# EAGLE design Mixer-Analog-OPA2134-Rev-K2 (EAGLE 8.5.2)
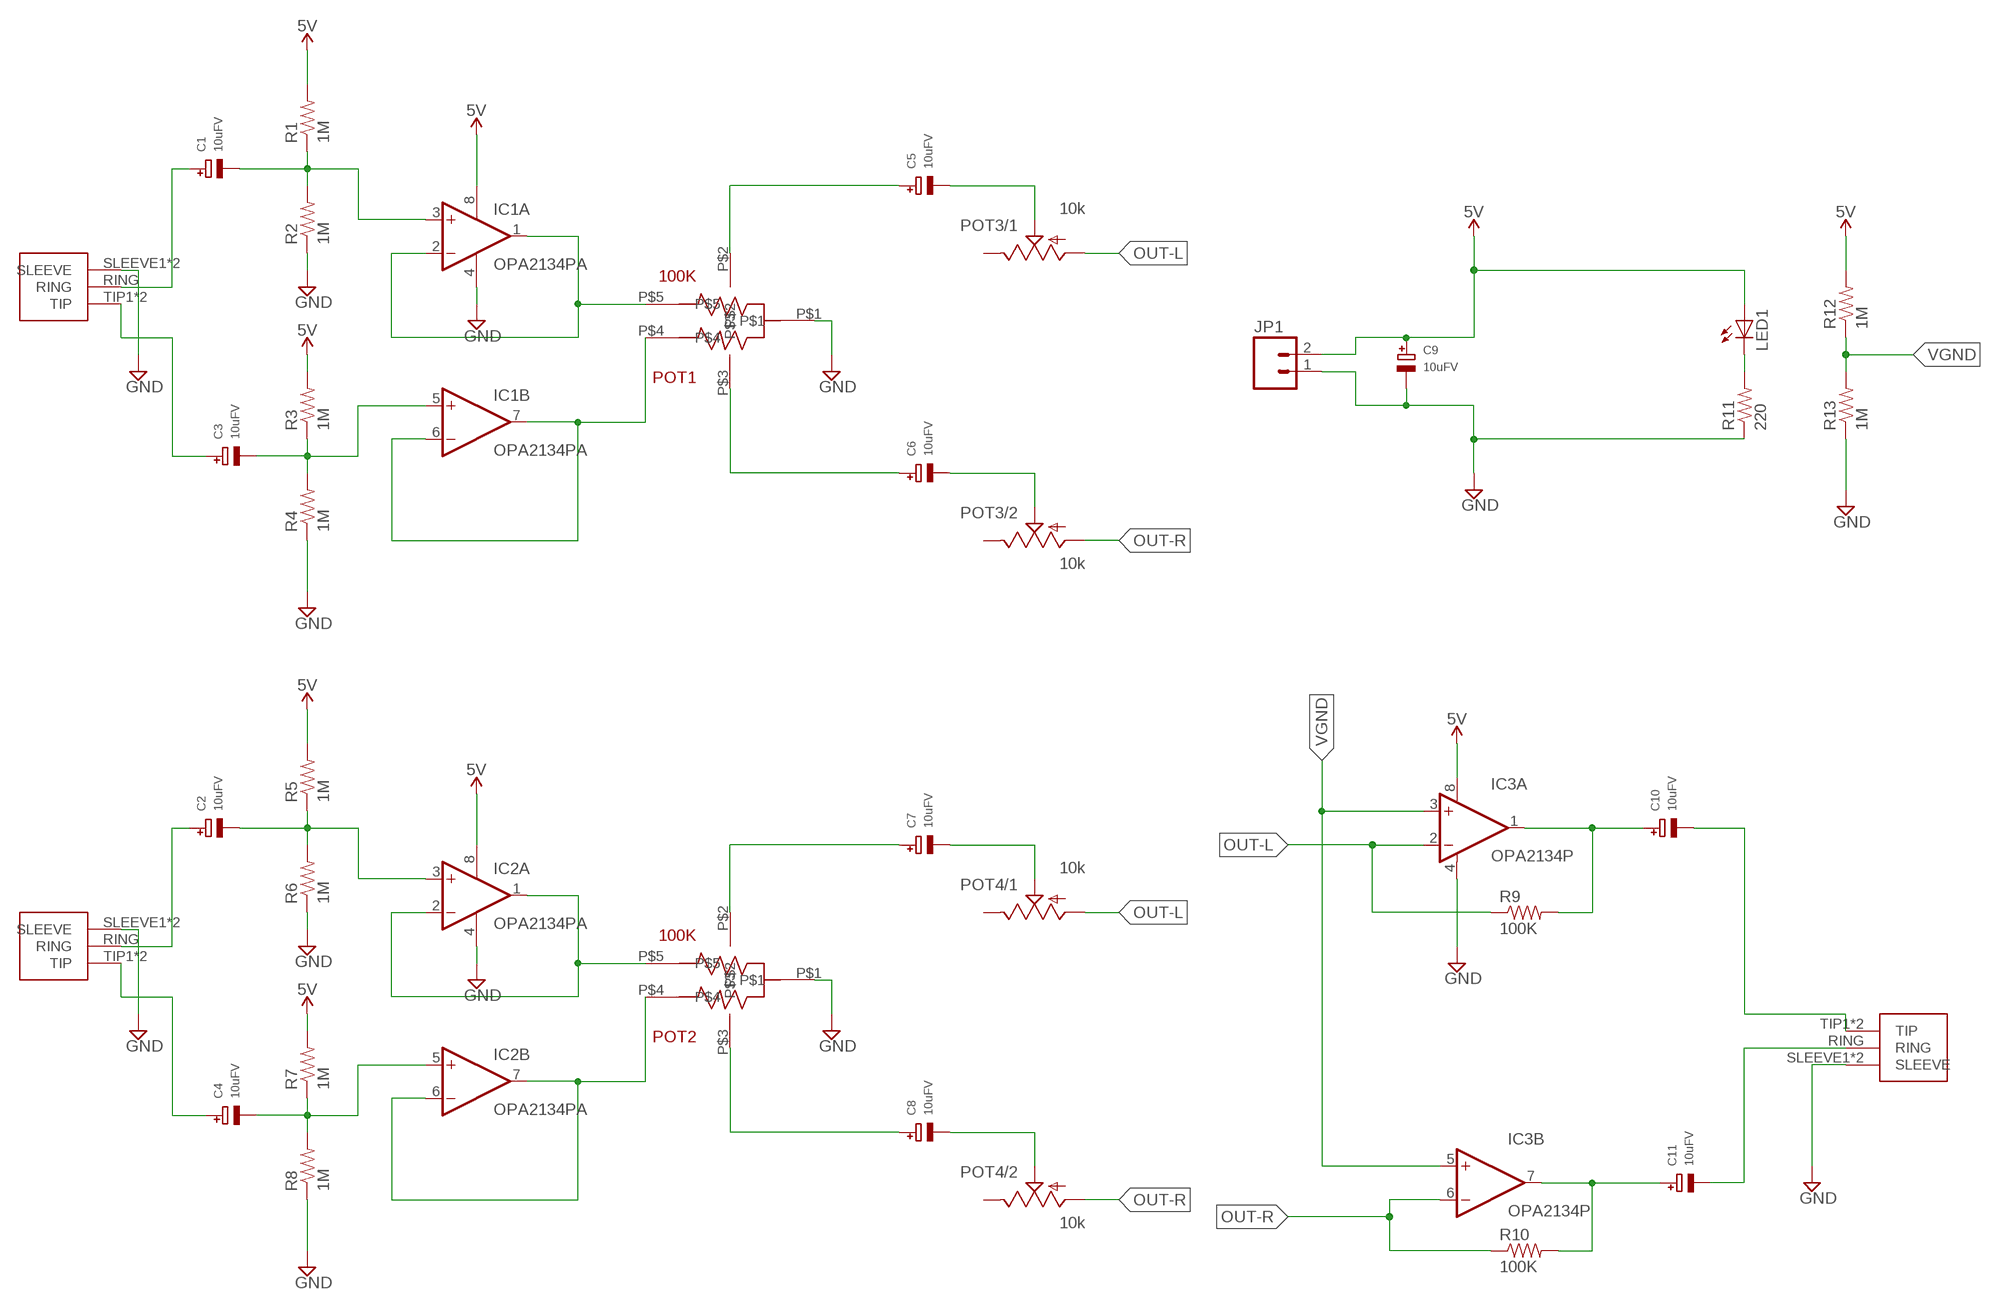
[diagram p0: schematic, sheet 1]

## Parts
C1  10uFV  CAP_ELECTROLYTICPTH_3.5MMGRID_8MMDIA  [CELEC_3.5MM_8MM]
C2  10uFV  CAP_ELECTROLYTICPTH_3.5MMGRID_8MMDIA  [CELEC_3.5MM_8MM]
C3  10uFV  CAP_ELECTROLYTICPTH_3.5MMGRID_8MMDIA  [CELEC_3.5MM_8MM]
C4  10uFV  CAP_ELECTROLYTICPTH_3.5MMGRID_8MMDIA  [CELEC_3.5MM_8MM]
C5  10uFV  CAP_ELECTROLYTICPTH_3.5MMGRID_8MMDIA  [CELEC_3.5MM_8MM]
C6  10uFV  CAP_ELECTROLYTICPTH_3.5MMGRID_8MMDIA  [CELEC_3.5MM_8MM]
C7  10uFV  CAP_ELECTROLYTICPTH_3.5MMGRID_8MMDIA  [CELEC_3.5MM_8MM]
C8  10uFV  CAP_ELECTROLYTICPTH_3.5MMGRID_8MMDIA  [CELEC_3.5MM_8MM]
C9  10uFV  CAP_ELECTROLYTICPTH_3.5MMGRID_8MMDIA  [CELEC_3.5MM_8MM]
C10  10uFV  CAP_ELECTROLYTICPTH_3.5MMGRID_8MMDIA  [CELEC_3.5MM_8MM]
C11  10uFV  CAP_ELECTROLYTICPTH_3.5MMGRID_8MMDIA  [CELEC_3.5MM_8MM]
IC1  OPA2134PA  [DIL08]
IC2  OPA2134PA  [DIL08]
IC3  OPA2134P  [DIL08]
J1  1/8"-F-STEREO-PCB  [1/8"-F-STEREO-PCB]
J2  1/8"-F-STEREO-PCB  [1/8"-F-STEREO-PCB]
J3  1/8"-F-STEREO-PCB  [1/8"-F-STEREO-PCB]
JP1  M02LOCK  [1X02_LOCK]
LED1  LED3MM  [LED3MM]
POT1  100K  POT-DUAL-ALPS-RK10J12E0A0A  [POT-DUAL-ALPS-RK10J12E0A0A]
POT2  100K  POT-DUAL-ALPS-RK10J12E0A0A  [POT-DUAL-ALPS-RK10J12E0A0A]
POT3  10k  POT-DUAL-PTV112-4420  [PTV112]
POT4  10k  POT-DUAL-PTV112-4420  [PTV112]
R1  1M  RESISTOREZ  [AXIAL-0.3EZ]
R2  1M  RESISTORAXIAL-0.3  [AXIAL-0.3]
R3  1M  RESISTOREZ  [AXIAL-0.3EZ]
R4  1M  RESISTOREZ  [AXIAL-0.3EZ]
R5  1M  RESISTOREZ  [AXIAL-0.3EZ]
R6  1M  RESISTORAXIAL-0.3  [AXIAL-0.3]
R7  1M  RESISTOREZ  [AXIAL-0.3EZ]
R8  1M  RESISTOREZ  [AXIAL-0.3EZ]
R9  100K  RESISTOREZ  [AXIAL-0.3EZ]
R10  100K  RESISTOREZ  [AXIAL-0.3EZ]
R11  220  RESISTOREZ  [AXIAL-0.3EZ]
R12  1M  RESISTOREZ  [AXIAL-0.3EZ]
R13  1M  RESISTOREZ  [AXIAL-0.3EZ]

## Nets
5V: C9.+ IC1.8(A:V+) IC2.8(A:V+) IC3.8(A:V+) JP1.2 LED1.A R1.P$2 R3.P$2 R5.P$2 R7.P$2 R12.P$2
GND: C9.- IC1.4(A:V-) IC2.4(A:V-) IC3.4(A:V-) J1.SLEEVE1(SLEEVE) J1.SLEEVE2(SLEEVE) J2.SLEEVE1(SLEEVE) J2.SLEEVE2(SLEEVE) J3.SLEEVE1(SLEEVE) J3.SLEEVE2(SLEEVE) JP1.1 POT1.P$1 POT2.P$1 R2.P$1 R4.P$1 R6.P$1 R8.P$1 R11.P$1 R13.P$1
N$1: C5.+ POT1.P$2
N$2: C5.- POT3.1.2(/1:S)
N$3: C6.+ POT1.P$3
N$4: C7.- POT4.1.2(/1:S)
N$5: C1.+ J1.RING
N$6: C6.- POT3.2.2(/2:S)
N$7: C10.+ IC3.1(A:OUT) R9.P$2
N$8: C1.- IC1.3(A:+IN) R1.P$1 R2.P$2
N$9: C3.+ J1.TIP1(TIP) J1.TIP2(TIP)
N$10: C8.- POT4.2.2(/2:S)
N$11: C2.+ J2.RING
N$12: C4.+ J2.TIP1(TIP) J2.TIP2(TIP)
N$13: C2.- IC2.3(A:+IN) R5.P$1 R6.P$2
N$14: C4.- IC2.5(B:+IN) R7.P$1 R8.P$2
N$15: LED1.K(C) R11.P$2
N$16: IC2.6(B:-IN) IC2.7(B:OUT) POT2.P$4
N$17: C11.+ IC3.7(B:OUT) R10.P$2
N$18: C3.- IC1.5(B:+IN) R3.P$1 R4.P$2
N$19: IC1.6(B:-IN) IC1.7(B:OUT) POT1.P$4
N$20: C7.+ POT2.P$2
N$21: C8.+ POT2.P$3
N$61: C10.- J3.TIP1(TIP) J3.TIP2(TIP)
N$62: C11.- J3.RING
OUT-L: IC3.2(A:-IN) POT3.1.1(/1:A) POT4.1.1(/1:A) R9.P$1
OUT-R: IC3.6(B:-IN) POT3.2.1(/2:A) POT4.2.1(/2:A) R10.P$1
POT1: IC1.1(A:OUT) IC1.2(A:-IN) POT1.P$5
POT2: IC2.1(A:OUT) IC2.2(A:-IN) POT2.P$5
VGND: IC3.3(A:+IN) IC3.5(B:+IN) R12.P$1 R13.P$2
Unconnected: POT3.1.3(/1:E) POT3.2.3(/2:E) POT4.1.3(/1:E) POT4.2.3(/2:E)

## Library data of the parts
C1-C11 = microbuilder:CAP_ELECTROLYTIC: Electrolytic Capacitors SMT PANASONIC_C - Size C Panasonic Electrolytic Aluminum Capacitor 47µF 16V 20% Electrolytic Capacitor [Digikey: PCE3890TR-ND] PANASONIC_D - Size D Panasonic Electrolytic Aluminum Capacitor 100µF 25V 20% Electrolytic Capacitor [Digikey: PCE3898TR-ND] PTH 3.5 mm grid, 8 mm diameter ... 3.5 mm grid, 10 mm diameter ...
IC1 IC2 = linear:OPA2*: Dual Operational Amplifier Low Power, Single-Supply, Rail-To-Rail Operational Amplifier Source: http://focus.ti.com/lit/ds/symlink/opa2345.pdf http://focus.ti.com .. opa241.pdf http://focus.ti.com/lit/ds/symlink/opa2134.pdf
IC3 = burr-brown:OPA2134: Operational Amplifier; MF: TEXAS INSTRUMENTS; MPN: OPA2134PA; OC_FARNELL: 1097574; OC_NEWARK: 74K3897
J1-J3 = CMU-ArtFab:1/8"-F-STEREO-PCB
JP1 = CMU-ArtFab:M02: Header 2 Standard 2-pin 0.1" header. Use with straight break away headers (SKU : PRT-00116), right angle break away headers (PRT-00553), swiss pins (PRT-00743), machine pins (PRT-00117), and female headers (PRT-00115). Molex polarized connector foot print use with SKU : PRT-08233 with associated crimp pins and housings.
LED1 = led:LED: LED OSRAM: - CHIPLED LG R971, LG N971, LY N971, LG Q971, LY Q971, LO R971, LY R971 LH N974, LH R974 LS Q976, LO Q976, LY Q976 LO Q996 - Hyper CHIPLED LW Q18S LB Q993, LB Q99A, LB R99A - SideLED LS A670, LO A670, LY A670, LG A670, LP A670 LB A673, LV A673, LT A673, LW A673 LH A674 LY A675 LS A676, LA A676, LO A676, LY A676, LW A676 LS A679, LY A679, LG A679 - Hyper Micro SIDELED® LS Y876, LA Y876, LO Y876, LY Y876 LT Y87S - SmartLED LW L88C, LW L88S LB L89C, LB L89S, LG L890 LS L89K, LO L89K, LY L89K LS L896, LA L896, LO L896, LY L896 - TOPLED LS T670, LO T670, LY T670, LG T670, LP T670 LSG T670, LSP T670, LSY T670, LOP T670, LYG T670 LG T671, LOG T671, LSG T671 LB T673, LV T673, LT T673, LW T673 LH T674 LS T676, LA T676, LO T676, LY T676, LB T676, LH T676, LSB T676, LW T676 LB T67C, LV T67C, LT T67C, LS T67K, LO T67K, LY T67K, LW E67C LS E67B, LA E67B, LO E67B, LY E67B, LB E67C, LV E67C, LT E67C LW T67C LS T679, LY T679, LG T679 LS T770, LO T770, LY T770, LG T770, LP T770 LB T773, LV T773, LT T773, LW T773 LH T774 LS E675, LA E675, LY E675, LS T675 LS T776, LA T776, LO T776, LY T776, LB T776 LHGB T686 LT T68C, LB T68C - Hyper Mini TOPLED® LB M676 - Mini TOPLED Santana® LG M470 LS M47K, LO M47K, LY M47K Source: http://www.osram.convergy.de LUXEON: - LUMILED® LXK2-PW12-R00, LXK2-PW12-S00, LXK2-PW14-U00, LXK2-PW14-V00 LXK2-PM12-R00, LXK2-PM12-S00, LXK2-PM14-U00 LXK2-PE12-Q00, LXK2-PE12-R00, LXK2-PE12-S00, LXK2-PE14-T00, LXK2-PE14-U00 LXK2-PB12-K00, LXK2-PB12-L00, LXK2-PB12-M00, LXK2-PB14-N00, LXK2-PB14-P00, LXK2-PB14-Q00 LXK2-PR12-L00, LXK2-PR12-M00, LXK2-PR14-Q00, LXK2-PR14-R00 LXK2-PD12-Q00, LXK2-PD12-R00, LXK2-PD12-S00 LXK2-PH12-R00, LXK2-PH12-S00 LXK2-PL12-P00, LXK2-PL12-Q00, LXK2-PL12-R00 Source: www.luxeon.com KINGBRIGHT: KA-3528ASYC Source: www.kingbright.com
POT1 POT2 = CMU-ArtFab:POT-DUAL-ALPS-RK10J12E0A0A
POT3 POT4 = CMU-ArtFab:POT-DUAL-PTV112: Bourns 11mm dual potentiometer; AVAILABILITY: Unavailable; DESCRIPTION: Alt# Tce-10111410; MF: STMicroelectronics; MP: PTV112; PACKAGE: None; PRICE: None; SPICEPREFIX: J
R1-R10 = SparkFun-Passives:RESISTOR: Resistor Basic schematic elements and footprints for 0603, 1206, and PTH resistors.; SPICEPREFIX: R
R11-R13 = SparkFun-Passives:RESISTOR: Resistor Basic schematic elements and footprints for 0603, 1206, and PTH resistors.

## Board
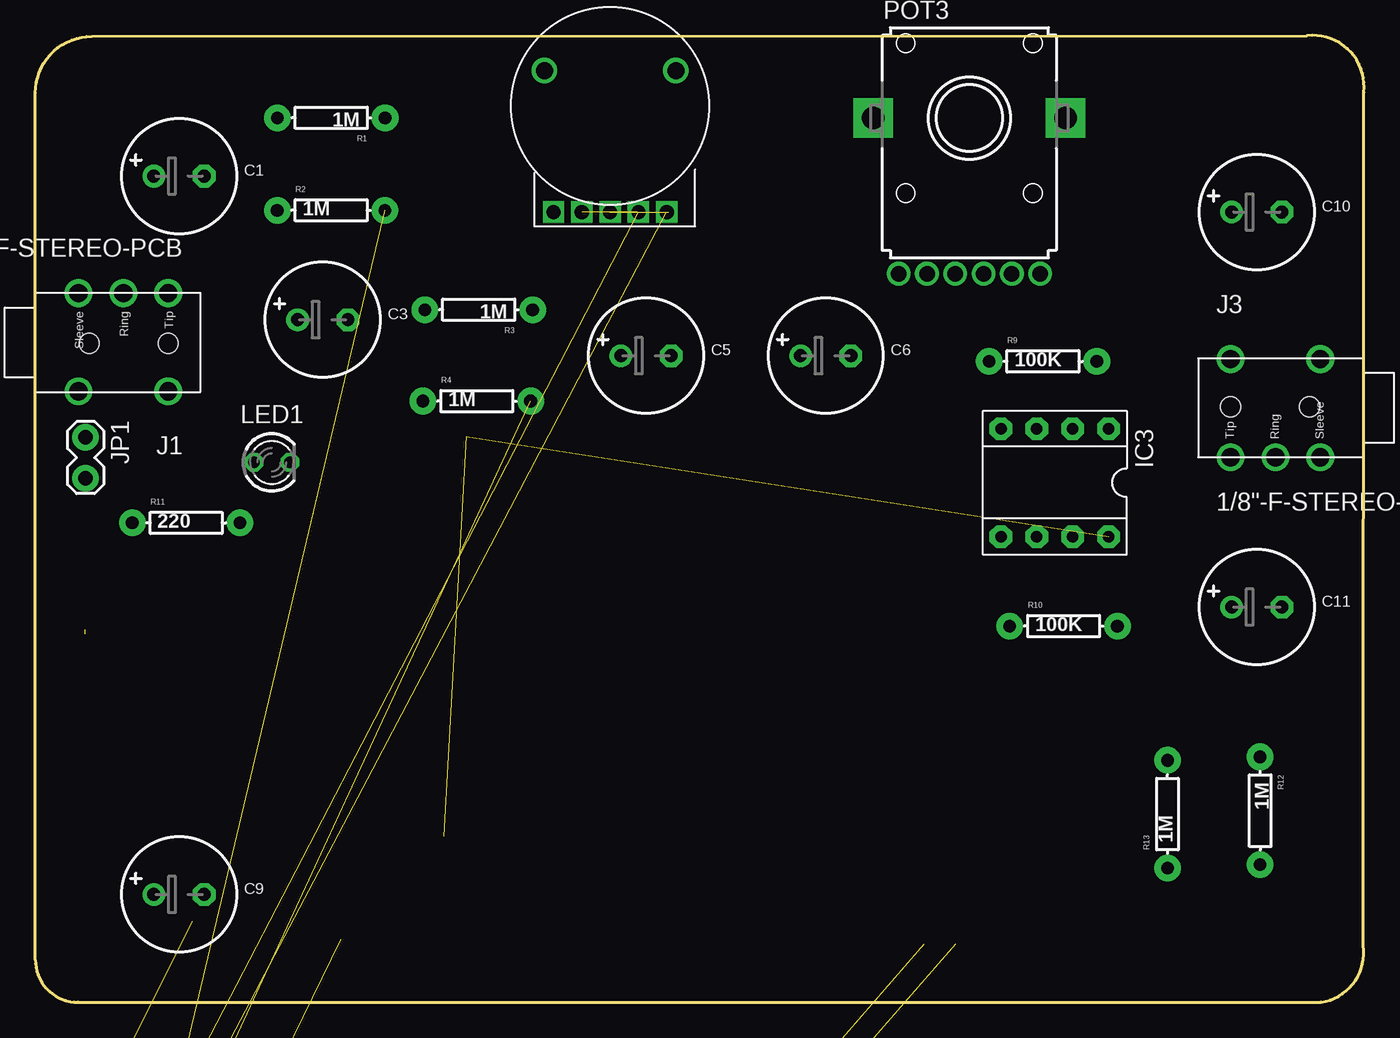
[diagram p1: board, top side]
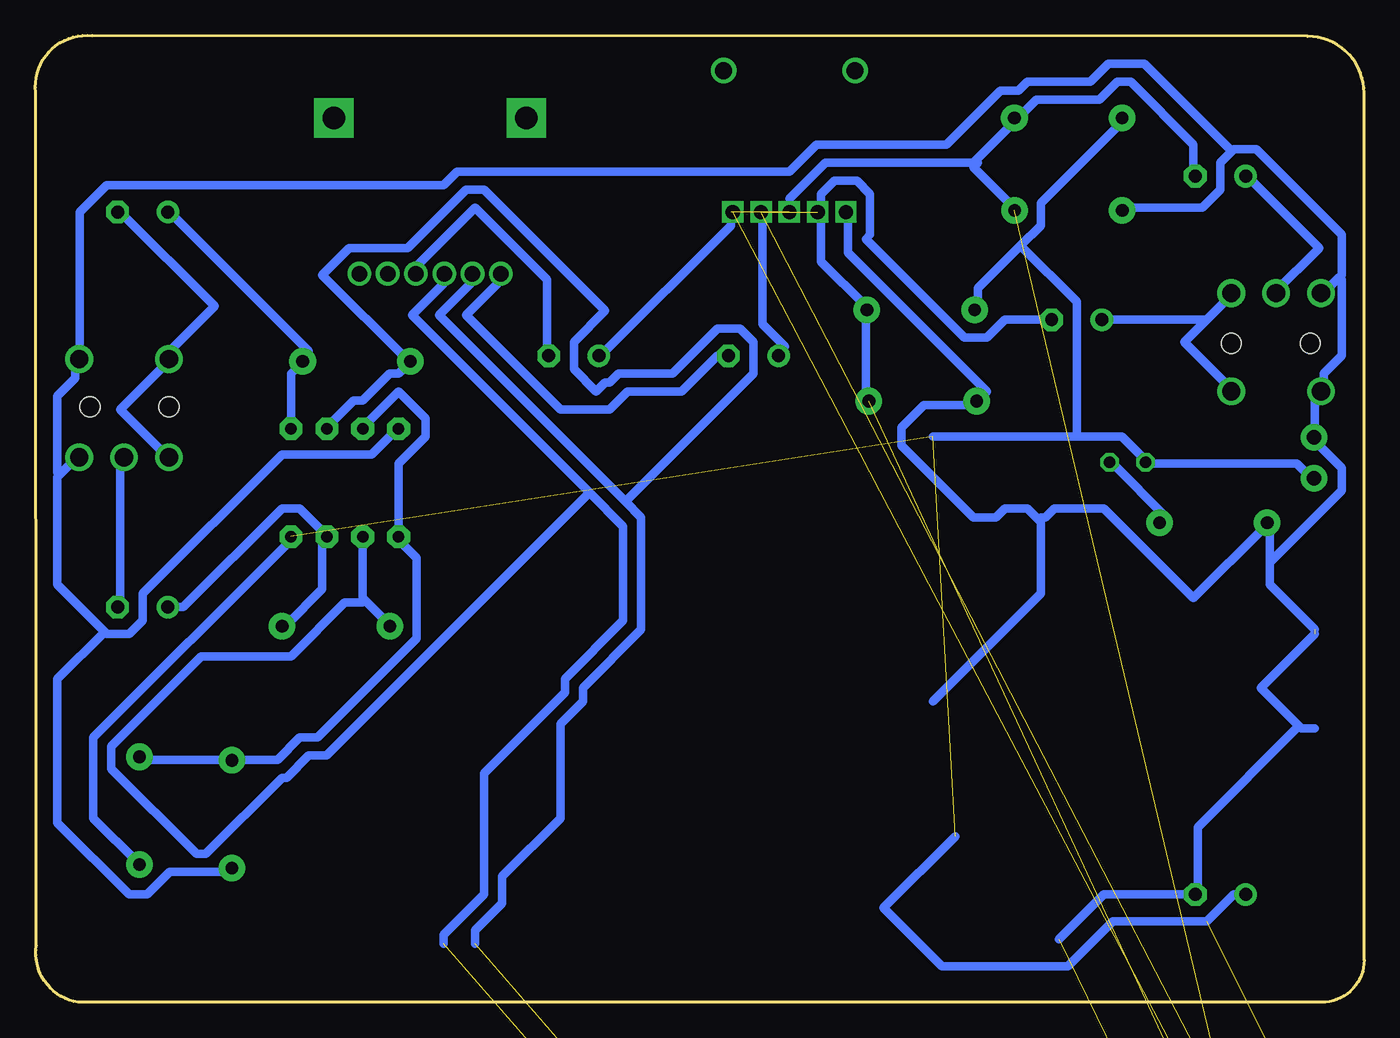
[diagram p2: board, bottom side, seen from below]

Size 93.95 x 68.37 mm. Coordinates in mm from the lower left corner, seen from the top.
Outline: 0,3 arc90 3,0 90.92,0 arc90 93.88,4 93.93,64.35 arc103 89.93,68.35 4,68.3 arc90 0,64.3 0,3
Copper layers (1*16): Top 0.035mm / dielectric 1.5mm / Bottom 0.035mm
Design rules "default *": minimum track width 24mil, minimum drill 0.35mm, track to track 24mil, track to pad 24mil, pad to pad 24mil, via to via 24mil, smd to smd 24mil, copper to edge 40mil, drill to drill 6mil, minimum pad ring 10mil, minimum via ring 8mil, stop-mask expansion 4mil, vias tented up to drill 0mil, thermal gap 10mil

### Footprints (pad centres in the part's own frame; a part is rotated, then mirrored left to right if it is on the bottom)
CELEC_3.5MM_8MM = drill 0.914 pad 1.6: + -1.778,0 | drill 0.914 pad 1.6 octagon: - 1.778,0
DIL08 = drill 0.813 pad 1.27: 1 -3.81,-3.81; 2 -1.27,-3.81; 3 1.27,-3.81; 4 3.81,-3.81; 5 3.81,3.81; 6 1.27,3.81; 7 -1.27,3.81; 8 -3.81,3.81
DIL08' = drill 0.813 pad 1.6 octagon: 1 -3.81,-3.81; 2 -1.27,-3.81; 3 1.27,-3.81; 4 3.81,-3.81; 5 3.81,3.81; 6 1.27,3.81; 7 -1.27,3.81; 8 -3.81,3.81
1/8"-F-STEREO-PCB = drill 1.3: RING 5.461,0; SLEEVE1 8.636,6.934; SLEEVE2 8.636,0; TIP1 2.286,6.934; TIP2 2.286,0 | hole 1.4: 2.286,3.556; 7.874,3.556
1X02_LOCK = drill 1.016 pad 1.88: 1 -0.178,0; 2 2.718,0
LED3MM = drill 0.813 octagon: A -1.27,0; K 1.27,0
POT-DUAL-ALPS-RK10J12E0A0A = drill 1 pad 1.321 square: P$1 -4,0; P$2 -2,0; P$3 0,0; P$4 2,0; P$5 4,0 | drill 1.2: P$6 4.65,10; P$7 -4.65,10
PTV112 = drill 1.1 pad 1.676: 1.1 -3,-11; 1.2 -5,-11; 1.3 5,-11; 2.1 -1,-11; 2.2 1,-11; 2.3 3,-11 | drill 1.6 pad 2.8 square: M1 -6.8,0; M2 6.8,0
AXIAL-0.3EZ = drill 0.9 pad 1.88: P$1 -3.81,0; P$2 3.81,0
AXIAL-0.3 = drill 0.9 pad 1.88: P$1 -3.81,0; P$2 3.81,0

### Placement (x,y rotation side)
C1  10.16,58.42 0 top
C2  2.54,-119.38 0 top  (outside the outline)
C3  20.32,48.26 0 top
C4  22.86,-119.38 0 top  (outside the outline)
C5  43.18,45.72 0 top
C6  55.88,45.72 0 top
C7  43.18,-119.38 0 top  (outside the outline)
C8  63.5,-119.38 0 top  (outside the outline)
C9  10.16,7.62 0 top
C10  86.36,55.88 0 top
C11  86.36,27.94 0 top
IC1  5.08,-17.78 0 top  (outside the outline)
IC2  33.02,-73.66 0 top  (outside the outline)
IC3  OPA2134P  [DIL08']  72.08,36.74 180 top
J1  11.68,50.15 180 top
J2  2.54,-81.28 0 top  (outside the outline)
J3  82.22,38.54 0 top
JP1  3.55,39.78 270 top
LED1  16.72,38.18 0 top
POT1  40.64,55.88 0 top
POT2  50.8,-48.26 0 top  (outside the outline)
POT3  66.04,62.52 0 top
POT4  15.24,-43.18 0 top  (outside the outline)
R1  20.92,62.54 180 top
R2  20.91,56 0 top
R3  31.35,48.97 180 top
R4  31.21,42.51 0 top
R5  58.42,-73.66 0 top  (outside the outline)
R6  7.62,-101.6 0 top  (outside the outline)
R7  35.56,-101.6 0 top  (outside the outline)
R8  63.5,-101.6 0 top  (outside the outline)
R9  71.24,45.32 0 top
R10  72.7,26.6 0 top
R11  10.66,33.9 0 top
R12  86.6,13.54 270 top
R13  80.05,13.3 90 top

### Tracks (layer width: path | path; a pad name or v marks a point on that pad's centre or on a via)
5V  (6 unrouted)
  Bottom 0.61: IC3.8 76.2,32.7 76.2,32.38 89.85,18.73 89.85,13.02 86.68,9.84 R12.P$2 | 24.29,53.5 22.86,54.93 22.86,56.52 17.14,62.23 R1.P$2 | 24.29,53.5 27.3,50.48 27.3,49.21 R3.P$2 | JP1.2 3.81,37.15 4.76,38.1 15.24,38.1 LED1.A 15.56,38.42 17.14,40.01 20.32,40.01 | 20.32,40.01 30.48,40.01 | 24.29,53.5 20.32,49.53 20.32,40.01 | C9.+ 9.21,7.62 11.11,5.71 17.78,5.71 20.95,2.54 29.84,2.54 33.97,6.67 28.89,11.75
GND  (8 unrouted)
  Bottom 0.61: POT1.P$1 36.51,55.88 36.51,53.02 26.67,43.18 27.3,42.55 R4.P$1 27.62,42.23 31.11,42.23 32.7,40.64 32.7,39.37 27.62,34.29 26.04,34.29 25.4,34.92 23.81,34.92 23.02,34.13 | 23.02,34.13 22.86,33.97 22.86,28.89 30.48,21.27 | 89.06,26.19 92.39,29.53 92.39,37.15 92.23,37.31 | 89.06,26.19 88.9,26.04 87.31,26.04 86.36,26.99 86.36,28.89 76.52,38.73 70.17,38.73 68.58,40.32 IC3.4 | 92.23,37.31 91.12,38.42 J3.SLEEVE2 | 89.06,26.19 92.39,22.86 92.39,12.7 87.31,7.62 86.04,7.62 84.45,9.21 80.33,9.21 R13.P$1 | 92.23,37.31 92.39,37.47 92.39,42.86 91.12,44.13 91.12,45.4 J3.SLEEVE1 90.81,45.72 90.81,55.88 88.9,57.78 65.09,57.78 64.14,58.74 40.64,58.74 38.73,60.64 29.53,60.64 25.72,64.45 24.45,64.45 23.81,65.09 19.37,65.09 18.1,66.36 15.56,66.36 9.37,60.17 | 9.37,60.17 9.21,60.33 7.62,60.33 1.59,54.29 1.59,51.44 1.75,51.28 | 9.37,60.17 10.16,59.37 10.16,57.47 11.43,56.2 16.83,56.2 R2.P$1 | 1.75,51.28 2.86,50.16 J1.SLEEVE2 | 1.75,51.28 1.59,51.12 1.59,45.72 2.86,44.45 2.86,43.5 J1.SLEEVE1 3.17,43.18 3.49,42.86 3.49,40.01 JP1.1 3.49,39.69 1.59,37.78 1.59,36.2 6.67,31.11 | 21.59,4.45 18.41,7.62 C9.- 11.75,7.62 11.75,12.38 4.6,19.53 | 6.67,31.11 6.67,29.53 3.49,26.35 | 6.67,31.11 6.67,33.66 R11.P$1 6.99,33.66 12.06,28.57 18.41,34.92 21.91,34.92 22.54,34.29 22.86,34.29 23.02,34.13 | 3.49,19.37 4.45,19.37 4.6,19.53 | 4.6,19.53 7.3,22.23 3.49,26.04
N$1  (1 unrouted)
  Bottom 0.61: 42.55,55.88 42.55,47.94 40.96,46.35 41.59,45.72 C5.+
N$2
  Bottom 0.61: C5.- 45.72,45.72 48.26,43.18 52.07,43.18 53.34,41.91 56.83,41.91 63.5,48.58 61.28,50.8 61.28,51.44 POT3.1.2
N$3  (1 unrouted)
  Bottom 0.61: 44.77,55.88 44.77,54.93 53.98,45.72 C6.+
N$4  (1 unrouted)
N$5
  Bottom 0.61: C1.+ 8.26,58.42 3.17,53.34 6.35,50.16 J1.RING
N$6
  Bottom 0.61: C6.- 57.78,45.72 57.78,51.12 62.87,56.2 66.99,52.07 66.99,51.75 POT3.2.2
N$7
  Bottom 0.61: IC3.1 75.88,40.64 75.88,44.45 75.25,45.09 R9.P$2 75.25,45.4 74.61,46.04 84.45,55.88 C10.+
N$8  (1 unrouted)
  Bottom 0.61: 40.64,56.83 38.1,59.37 27.62,59.37 27.46,59.53 | 27.46,59.53 24.77,62.23 R1.P$1 24.45,62.55 23.18,63.82 18.73,63.82 17.46,65.09 16.51,65.09 12.06,60.64 12.06,58.42 C1.- | R2.P$2 24.77,56.2 27.62,59.05 27.3,59.37 27.46,59.53
N$9
  Bottom 0.61: 11.11,48.26 C3.+ | 11.11,48.26 9.53,49.85 J1.TIP2 | 11.11,48.26 12.7,46.67 9.53,43.5 J1.TIP1
N$10  (1 unrouted)
N$11  (1 unrouted)
N$12  (2 unrouted)
N$13  (3 unrouted)
N$14  (3 unrouted)
N$15
  Bottom 0.61: LED1.K 17.78,38.1 13.97,34.29 14.29,33.97 R11.P$2
N$16  (2 unrouted)
N$17
  Bottom 0.61: R10.P$2 76.2,26.67 73.66,29.21 73.66,32.7 IC3.7 73.34,33.02 75.25,34.92 76.52,34.92 83.5,27.94 C11.+
N$18  (1 unrouted)
  Bottom 0.61: C3.- 25.4,48.26 26.67,46.99 28.26,46.99 35.24,53.98 34.92,54.29 34.92,57.15 35.88,58.1 37.47,58.1 38.42,57.15 38.42,55.88 38.42,52.39 35.24,49.21 R3.P$1 35.24,48.9 35.24,42.55 R4.P$2
N$19  (2 unrouted)
N$20  (1 unrouted)
N$21  (1 unrouted)
N$61
  Bottom 0.61: C10.- 87.95,55.88 81.28,49.21 84.77,45.72 J3.TIP1 84.45,45.4 87.95,41.91 84.77,38.73 J3.TIP2
N$62
  Bottom 0.61: C11.- 87.95,27.94 87.95,38.42 J3.RING
OUT-L  (1 unrouted)
  Bottom 0.61: IC3.2 73.34,40.64 71.44,42.55 70.8,42.55 68.9,44.45 68.26,44.45 67.63,45.09 R9.P$1 67.63,45.4 73.66,51.44 71.75,53.34 67.63,53.34 63.5,57.47 62.23,57.47 53.66,48.9 55.88,46.67 55.88,44.77 54.29,43.18 53.66,43.81 53.34,43.81 52.7,44.45 48.9,44.45 45.72,47.62 44.13,47.62 43.18,46.67 43.18,44.45 52.23,35.4 | 62.87,4.13 62.87,5.08 60.96,6.99 60.96,8.89 56.83,13.02 56.83,19.68 55.24,21.27 55.24,22.23 51.12,26.35 51.12,34.29 52.23,35.4 | 52.23,35.4 65.41,48.58 63.18,50.8 63.18,51.44 POT3.1.1
OUT-R  (1 unrouted)
  Bottom 0.61: 70.64,28.42 68.9,26.67 R10.P$1 | 70.64,28.42 70.8,28.57 70.8,32.7 IC3.6 | 65.09,4.13 65.09,4.76 62.23,7.62 62.23,16.19 56.52,21.91 56.52,22.86 52.39,26.99 52.39,33.66 54.77,36.04 | 54.77,36.04 67.31,48.58 65.09,50.8 65.09,51.44 POT3.2.1 | 54.77,36.04 73.34,17.46 74.61,17.46 76.2,15.88 76.52,15.88 81.92,10.48 82.55,10.48 88.58,16.51 88.58,18.1 82.23,24.45 75.88,24.45 72.07,28.26 70.8,28.26 70.64,28.42
POT1  (2 unrouted)
POT2  (2 unrouted)
VGND
  Bottom 0.61: R12.P$1 86.36,17.14 80.33,17.14 R13.P$2 80.01,17.14 76.83,17.14 75.25,18.73 73.98,18.73 66.99,25.72 66.99,31.43 68.26,32.7 IC3.5 68.26,33.02 68.26,38.1 66.36,40.01 66.36,41.27 68.26,43.18 70.8,40.64 IC3.3